# Altium schematic sheet MCU.SchDoc
size A4
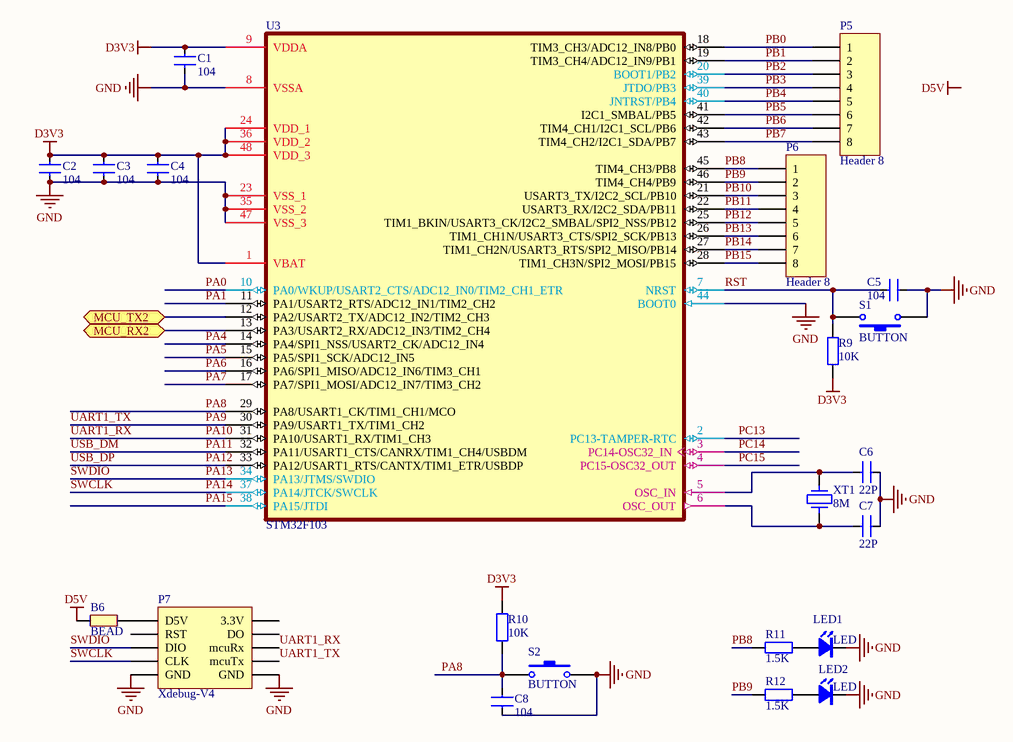
[diagram p0: MCU.SchDoc]

## Parts
B6  BEAD  [0603L]
C1  104  [0603C]
C2  104  [0603C]
C3  104  [0603C]
C4  104  [0603C]
C5  104  [0603C]
C6  22P  [0603C]
C7  22P  [0603C]
C8  104  [0603C]
LED1  LED  [0805D]
LED2  LED  [0805D]
P5  Header 8  [HDR1X8]
P6  Header 8  [HDR1X8]
P7  Xdebug-V4  [DC2.54-10]
R9  10K  [0603R]
R10  10K  [0603R]
R11  1.5K  [0603R]
R12  1.5K  [0603R]
S1  BUTTON  [SW-3X4X2]
S2  BUTTON  [SW-3X4X2]
U3  STM32F103  [LQFP48]
XT1  8M  [5032]

## Ports
MCU_RX2 (bidir), MCU_TX2 (bidir)

## Nets
D3V3: C1.2 C2.2 C3.1 C4.2 R9.1 R10.1 U3.1(VBAT) U3.9(VDDA) U3.24(VDD_1) U3.36(VDD_2) U3.48(VDD_3)
D5V: B6.2
GND: C1.1 C2.1 C3.2 C4.1 C5.2 C6.2 C7.2 C8.1 LED1.K LED2.K P7.9(GND) P7.10(GND) S1.1 S2.2 U3.8(VSSA) U3.23(VSS_1) U3.35(VSS_2) U3.44(BOOT0) U3.47(VSS_3)
MCU_RX2: U3.13(PA3/USART2_RX/ADC12_IN3/TIM2_CH4) ; port MCU_RX2
MCU_TX2: U3.12(PA2/USART2_TX/ADC12_IN2/TIM2_CH3) ; port MCU_TX2
PA0: U3.10(PA0/WKUP/USART2_CTS/ADC12_IN0/TIM2_CH1_ETR)
PA1: U3.11(PA1/USART2_RTS/ADC12_IN1/TIM2_CH2)
PA4: U3.14(PA4/SPI1_NSS/USART2_CK/ADC12_IN4)
PA5: U3.15(PA5/SPI1_SCK/ADC12_IN5)
PA6: U3.16(PA6/SPI1_MISO/ADC12_IN6/TIM3_CH1)
PA7: U3.17(PA7/SPI1_MOSI/ADC12_IN7/TIM3_CH2)
PA8: C8.2 R10.2 S2.1 U3.29(PA8/USART1_CK/TIM1_CH1/MCO)
PA9: P7.8(mcuTx) U3.30(PA9/USART1_TX/TIM1_CH2)  [also labelled UART1_TX]
PA10: P7.6(mcuRx) U3.31(PA10/USART1_RX/TIM1_CH3)  [also labelled UART1_RX]
PA11: U3.32(PA11/USART1_CTS/CANRX/TIM1_CH4/USBDM)  [also labelled USB_DM]
PA12: U3.33(PA12/USART1_RTS/CANTX/TIM1_ETR/USBDP)  [also labelled USB_DP]
PA13: P7.5(DIO) U3.34(PA13/JTMS/SWDIO)  [also labelled SWDIO]
PA14: P7.7(CLK) U3.37(PA14/JTCK/SWCLK)  [also labelled SWCLK]
PA15: U3.38(PA15/JTDI)
PB0: P5.1 U3.18(TIM3_CH3/ADC12_IN8/PB0)
PB1: P5.2 U3.19(TIM3_CH4/ADC12_IN9/PB1)
PB2: P5.3 U3.20(BOOT1/PB2)
PB3: P5.4 U3.39(JTDO/PB3)
PB4: P5.5 U3.40(JNTRST/PB4)
PB5: P5.6 U3.41(I2C1_SMBAL/PB5)
PB6: P5.7 U3.42(TIM4_CH1/I2C1_SCL/PB6)
PB7: P5.8 U3.43(TIM4_CH2/I2C1_SDA/PB7)
PB8: P6.1 R11.1 U3.45(TIM4_CH3/PB8)
PB9: P6.2 R12.1 U3.46(TIM4_CH4/PB9)
PB10: P6.3 U3.21(USART3_TX/I2C2_SCL/PB10)
PB11: P6.4 U3.22(USART3_RX/I2C2_SDA/PB11)
PB12: P6.5 U3.25(TIM1_BKIN/USART3_CK/I2C2_SMBAL/SPI2_NSS/PB12)
PB13: P6.6 U3.26(TIM1_CH1N/USART3_CTS/SPI2_SCK/PB13)
PB14: P6.7 U3.27(TIM1_CH2N/USART3_RTS/SPI2_MISO/PB14)
PB15: P6.8 U3.28(TIM1_CH3N/SPI2_MOSI/PB15)
PC13: U3.2(PC13-TAMPER-RTC)
PC14: U3.3(PC14-OSC32_IN)
PC15: U3.4(PC15-OSC32_OUT)
RST: C5.1 R9.2 S1.2 U3.7(NRST)
NetB6_1: B6.1 P7.1(D5V)
NetC6_1: C6.1 U3.5(OSC_IN) XT1.1
NetC7_1: C7.1 U3.6(OSC_OUT) XT1.2
NetLED1_A: LED1.A R11.2
NetLED2_A: LED2.A R12.2

Not connected (* = marked no-connect by the designer): P7 2(3.3V) 3(RST) 4(DO)

## Notes on the sheet
- Labels drawn without touching a wire or pin: D5V, ENC1, ENC2, ENC3

## Library data of the parts
B6 = BEAD: 磁珠
C1-C8 = CAP: 普通小电容
P5 P6 = Header 8: Header, 8-Pin; LatestRevisionDate: 17-Jul-2002; LatestRevisionNote: Re-released for DXP Platform.; Publisher: Altium Limited
P7 = Xdebug-V4: 单片机端
R9-R12 = RES: 普通电阻
XT1 = XT: 晶振